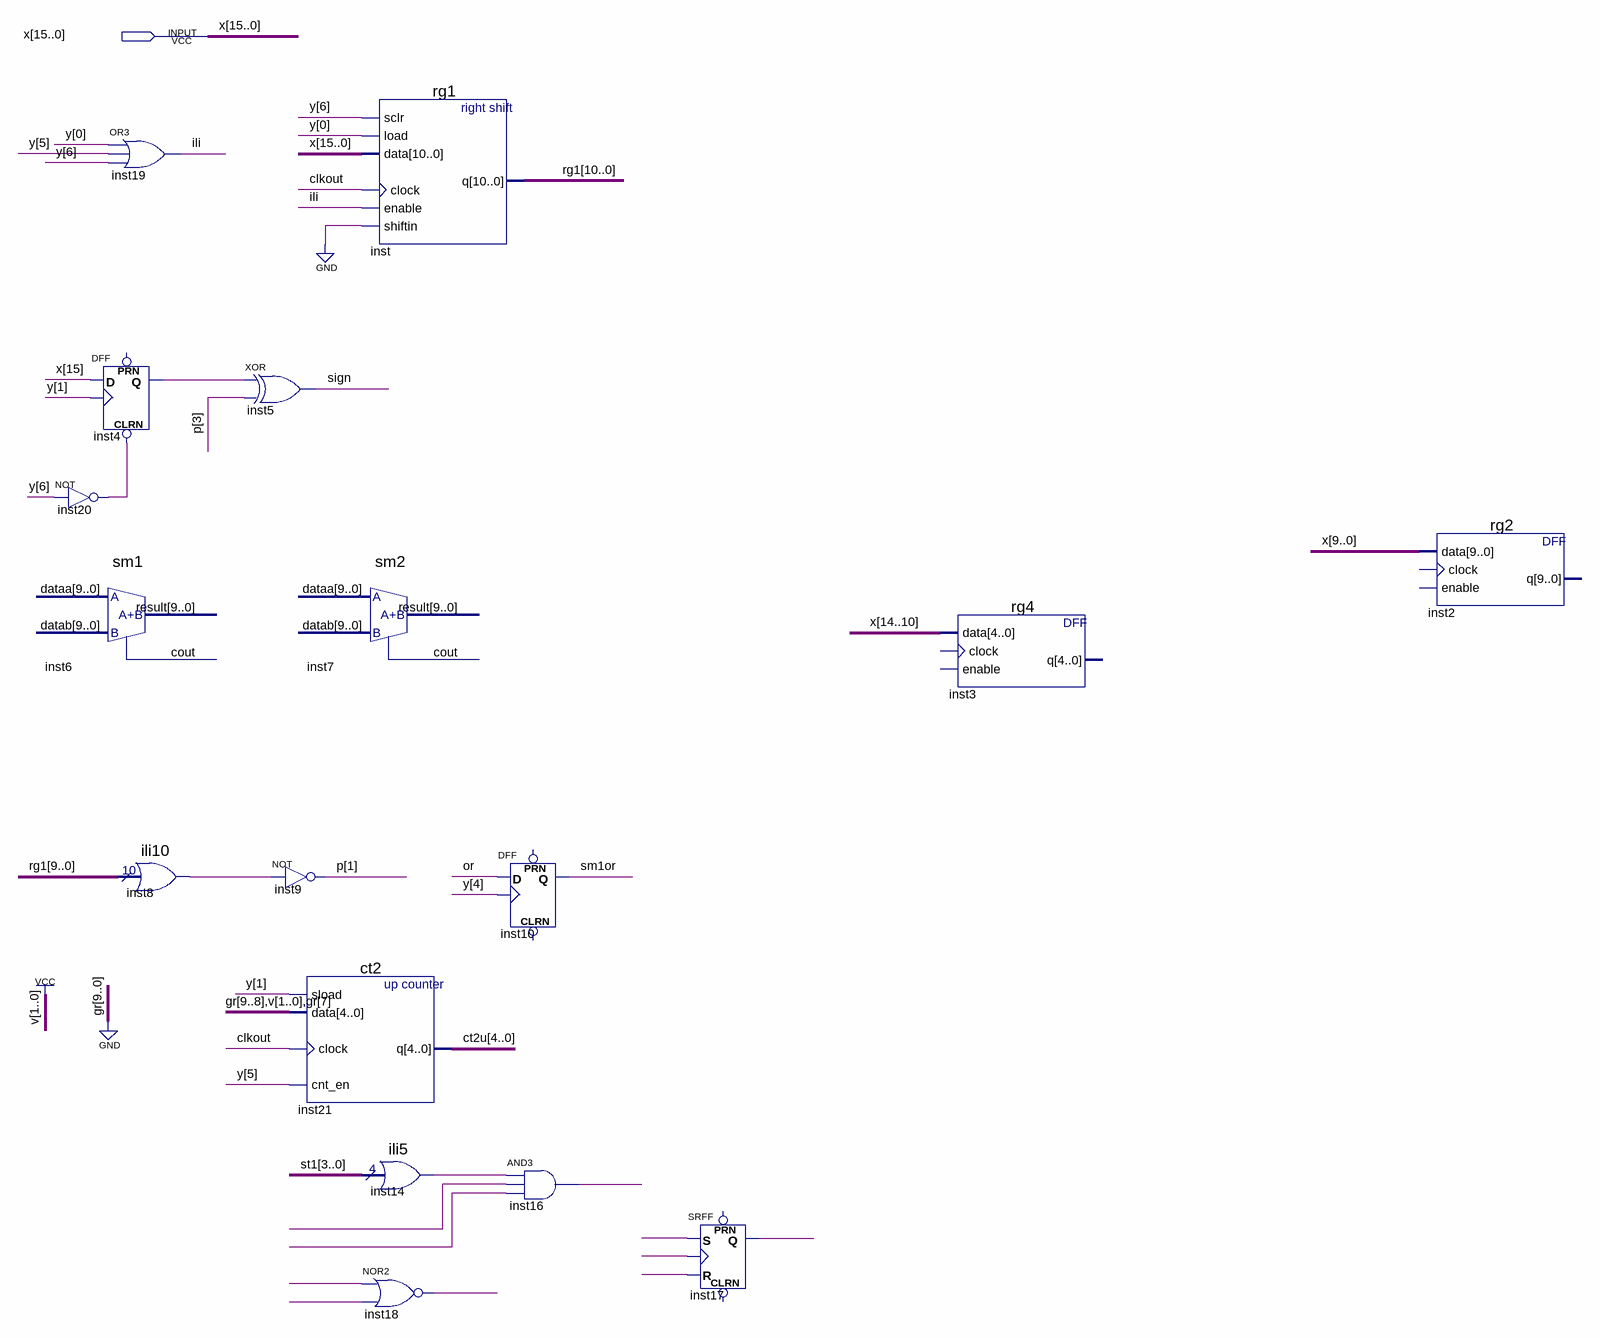
[diagram p0: schematic sheet]
// Quartus schematic 1.bdf as structural Verilog: 17 symbols, 1 pins
module \1  (
  input  [15:0] x
);

  wire clkout, ili, inst4_q, inst8_result, inst14_result, inst16_out, inst17_q, inst18_out, inst20_out, \or ,
       sign, sm1or, undriven, undriven_2, undriven_3, undriven_4, undriven_5, undriven_6, undriven_7;
  wire [3:0] st1;
  wire [3:1] p;
  wire [4:0] ct2u;
  wire [6:0] y;
  wire [10:0] rg1;

  not inst20 (inst20_out, y[6]);
  sm1 inst6 ();  // open: dataa, datab, result, cout
  or inst19 (ili, y[0], y[5], y[6]);
  DFF inst4 (.CLRN(inst20_out), .CLK(y[1]), .D(x[15]), .Q(inst4_q));  // open: PRN
  ili10 inst8 (.data(rg1[9:0]), .result(inst8_result));
  xor inst5 (sign, inst4_q, p[3]);
  not inst9 (p[1], inst8_result);
  sm2 inst7 ();  // open: dataa, datab, result, cout
  ct2 inst21 (.sload(y[1]), .data(5'b00110), .clock(clkout), .cnt_en(y[5]), .q(ct2u));
  rg1 inst (.sclr(y[6]), .load(y[0]), .data(x), .clock(clkout), .enable(ili), .shiftin(1'b0), .q(rg1));
  ili5 inst14 (.data(st1), .result(inst14_result));
  nor inst18 (inst18_out, undriven_3, undriven_4);
  DFF inst10 (.CLK(y[4]), .D(\or ), .Q(sm1or));  // open: CLRN, PRN
  and inst16 (inst16_out, inst14_result, undriven, undriven_2);
  SRFF inst17 (.S(undriven_5), .R(undriven_7), .CLK(undriven_6), .Q(inst17_q));  // open: PRN, CLRN
  rg4 inst3 (.data(x[14:10]));  // open: clock, enable, q
  rg2 inst2 (.data(x[9:0]));  // open: clock, enable, q
endmodule
